# EAGLE board e1_phy (EAGLE 9.0.1)
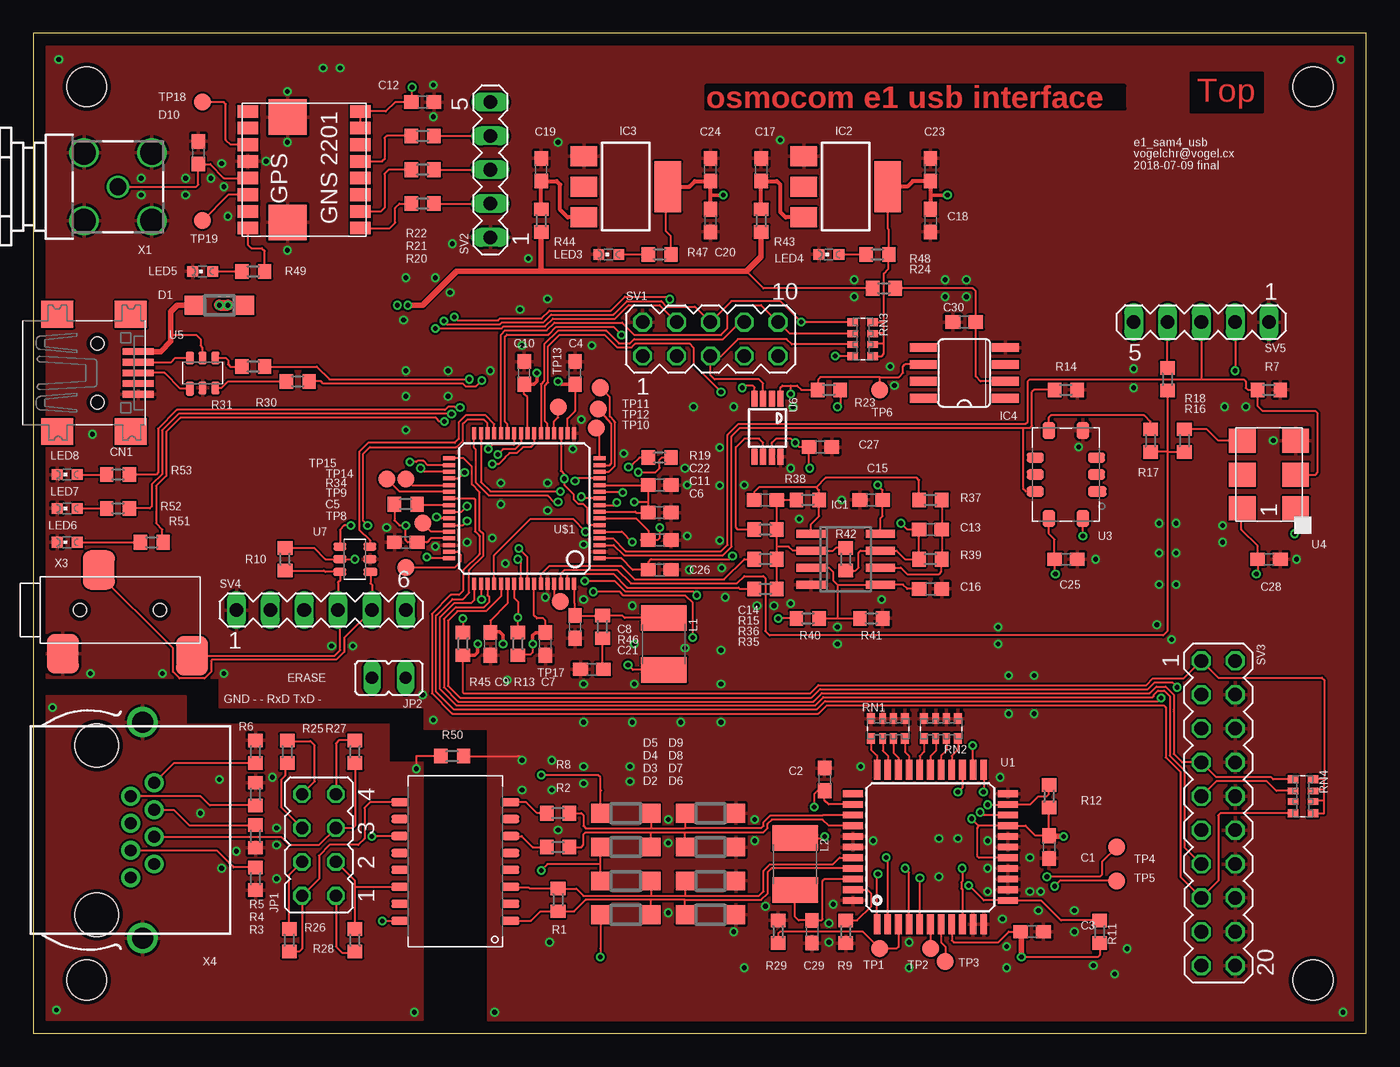
[diagram p1: board, top side]
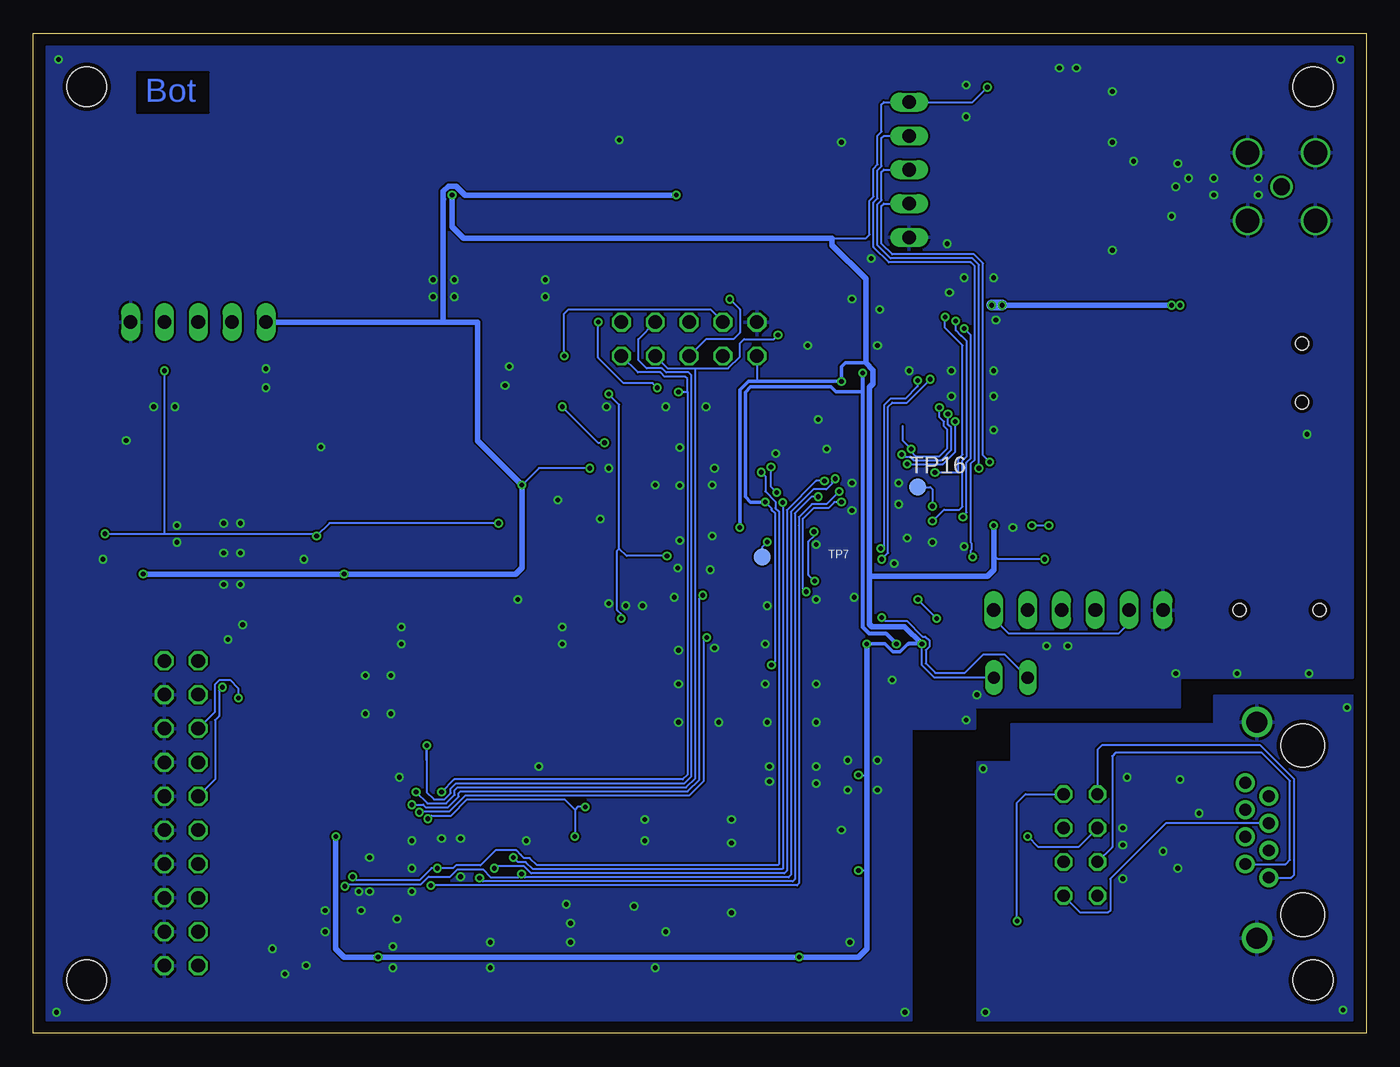
[diagram p2: board, bottom side, seen from below]

Size 100 x 75 mm. Coordinates in mm from the lower left corner, seen from the top.
Outline: 0,0 100,0 100,75 0,75 0,0
Copper layers (1*16): Top 0.035mm / dielectric 1.5mm / Bottom 0.035mm
Design rules "PCB-POOL Standard *": minimum track width 0.15mm, minimum drill 0.3mm, track to track 0.15mm, track to pad 0.15mm, pad to pad 0.15mm, via to via 0.15mm, smd to smd 0.15mm, copper to edge 0.3mm, drill to drill 0.2mm, minimum pad ring 0.2mm, minimum via ring 0.15mm, stop-mask expansion 0.075mm, vias tented up to drill 18mil, thermal gap 0.2mm
Holes 3 mm at 96,4 4,4 4,71 96,71

## Footprints (pad centres in the part's own frame; a part is rotated, then mirrored left to right if it is on the bottom)
C0603 = smd 1.1 x 1: 1 -0.85,0; 2 0.85,0
USB-MINIB = smd 0.5 x 2.308: D+ 0,4.064; D- -0.8,4.064; GND 1.6,4.064; ID 0.8,4.064; VBUS -1.6,4.064 | smd 2 x 2.4: GND1 -4.4,-2; GND2 -4.4,3.5; GND3 4.4,3.5; GND4 4.4,-2 | hole 1: -2.2,1; 2.2,1
SOD123 = smd 1.4 x 1.4: A 1.9,0; C -1.9,0
0603 = smd 1.1 x 1: 1 -0.85,0; 2 0.85,0
SO08 = smd 0.6 x 2.2: 1 -1.905,-2.6; 2 -0.635,-2.6; 3 0.635,-2.6; 4 1.905,-2.6; 5 1.905,2.6; 6 0.635,2.6; 7 -0.635,2.6; 8 -1.905,2.6
SOT223 = smd 1.5 x 2: 1 -2.3,-3.15; 2 0,-3.15; 3 2.3,-3.15 | smd 3.8 x 2: 4 0,3.15
SO08' = smd 0.66 x 2.032: 1 -1.905,-3.073; 2 -0.635,-3.073; 3 0.635,-3.073; 4 1.905,-3.073; 5 1.905,3.073; 6 0.635,3.073; 7 -0.635,3.073; 8 -1.905,3.073
JP4Q = drill 0.914 octagon: 1 -3.81,-1.27; 2 -3.81,1.27; 3 -1.27,-1.27; 4 -1.27,1.27; 5 1.27,-1.27; 6 1.27,1.27; 7 3.81,-1.27; 8 3.81,1.27
JP1 = drill 0.914 long: 1 0,-1.27; 2 0,1.27
L1812 = smd 1.9 x 3.4: 1 -1.95,0; 2 1.95,0
CHIPLED_0603 = smd 0.8 x 0.8: A 0,-0.75; C 0,0.75
R0603 = smd 1 x 1.1: 1 -0.85,0; 2 0.85,0
EXB38V = smd 0.6 x 0.8: 1 -1.275,-0.75; 4 1.275,-0.75; 5 1.275,0.75; 8 -1.275,0.75 | smd 0.5 x 0.8: 2 -0.4,-0.75; 3 0.4,-0.75; 6 0.4,0.75; 7 -0.4,0.75
MA05-2 = drill 1.016 octagon: 1 -5.08,-1.27; 2 -5.08,1.27; 3 -2.54,-1.27; 4 -2.54,1.27; 5 0,-1.27; 6 0,1.27; 7 2.54,-1.27; 8 2.54,1.27; 9 5.08,-1.27; 10 5.08,1.27
MA05-1 = drill 1.016 long: 1 -5.08,0; 2 -2.54,0; 3 0,0; 4 2.54,0; 5 5.08,0
MA10-2 = drill 1.016 octagon: 1 -11.43,-1.27; 2 -11.43,1.27; 3 -8.89,-1.27; 4 -8.89,1.27; 5 -6.35,-1.27; 6 -6.35,1.27; 7 -3.81,-1.27; 8 -3.81,1.27; 9 -1.27,-1.27; 10 -1.27,1.27; 11 1.27,-1.27; 12 1.27,1.27; 13 3.81,-1.27; 14 3.81,1.27; 15 6.35,-1.27; 16 6.35,1.27; 17 8.89,-1.27; 18 8.89,1.27; 19 11.43,-1.27; 20 11.43,1.27
MA06-1 = drill 1.016 long: 1 -6.35,0; 2 -3.81,0; 3 -1.27,0; 4 1.27,0; 5 3.81,0; 6 6.35,0
B1,27 = smd 1.27 x 1.27: TP 0,0
PULSE_BH = smd 1.27 x 0.635: 1 -4.23,4.25; 2 -4.23,2.98; 3 -4.23,1.71; 4 -4.23,0.44; 5 -4.23,-0.83; 6 -4.23,-2.1; 7 -4.23,-3.37; 8 -4.23,-4.64; 9 4.1,-4.64; 10 4.1,-3.37; 11 4.1,-2.1; 12 4.1,-0.83; 13 4.1,0.44; 14 4.1,1.71; 15 4.1,2.98; 16 4.1,4.25
TQFP44 = smd 1.5 x 0.5: 1 -5.8,4; 2 -5.8,3.2; 3 -5.8,2.4; 4 -5.8,1.6; 5 -5.8,0.8; 6 -5.8,0; 7 -5.8,-0.8; 8 -5.8,-1.6; 9 -5.8,-2.4; 10 -5.8,-3.2; 11 -5.8,-4; 23 5.8,-4; 24 5.8,-3.2; 25 5.8,-2.4; 26 5.8,-1.6; 27 5.8,-0.8; 28 5.8,0; 29 5.8,0.8; 30 5.8,1.6; 31 5.8,2.4; 32 5.8,3.2; 33 5.8,4 | smd 0.5 x 1.5: 12 -4,-5.8; 13 -3.2,-5.8; 14 -2.4,-5.8; 15 -1.6,-5.8; 16 -0.8,-5.8; 17 0,-5.8; 18 0.8,-5.8; 19 1.6,-5.8; 20 2.4,-5.8; 21 3.2,-5.8; 22 4,-5.8; 34 4,5.8; 35 3.2,5.8; 36 2.4,5.8; 37 1.6,5.8; 38 0.8,5.8; 39 0,5.8; 40 -0.8,5.8; 41 -1.6,5.8; 42 -2.4,5.8; 43 -3.2,5.8; 44 -4,5.8
GPS_GNS_2201 = smd 0.95 x 1.55: 1 -4.375,-4.225; 2 -3.125,-4.225; 3 -1.875,-4.225; 4 -0.625,-4.225; 5 0.625,-4.225; 6 1.875,-4.225; 7 3.125,-4.225; 8 4.375,-4.225; 9 4.375,4.225; 10 3.125,4.225; 11 1.875,4.225; 12 0.625,4.225; 13 -0.625,4.225; 14 -1.875,4.225; 15 -3.125,4.225; 16 -4.375,4.225 | smd 2.65 x 2.85: E1 -3.95,-1.25; E2 3.95,-1.25
VCTCXO-CONNORWINFIELD = smd 0.76 x 1.38: 1 -1.27,-2.35 | smd 0.76 x 1.28: 2 0,-2.3; 3 1.27,-2.3; 6 1.27,2.3; 7 0,2.3; 8 -1.27,2.3 | smd 1.28 x 0.94: 4 3.3,-1.27; 5 3.3,1.27; 9 -3.3,1.27; 10 -3.3,-1.27
VCXO_TAITIEN_VT_7MM_5MM = smd 1.8 x 2: 1 -2.54,-2; 2 0,-2; 3 2.54,-2; 4 2.54,2; 5 0,2; 6 -2.54,2
TSOP-6 = smd 0.6 x 1.05: 1 -0.95,-1.175 | smd 0.6 x 0.95: 2 0,-1.125; 3 0.95,-1.125; 4 0.95,1.125; 5 0,1.125; 6 -0.95,1.125
UMAX8 = smd 0.45 x 1.2: 1 -0.975,-2.175; 2 -0.325,-2.175; 3 0.325,-2.175; 4 0.975,-2.175; 5 0.975,2.175; 6 0.325,2.175; 7 -0.325,2.175; 8 -0.975,2.175
LQFP-ST-64-2 = smd 0.9 x 0.3: 1 -5.65,3.75; 2 -5.65,3.25; 3 -5.65,2.75; 4 -5.65,2.25; 5 -5.65,1.75; 6 -5.65,1.25; 7 -5.65,0.75; 8 -5.65,0.25; 9 -5.65,-0.25; 10 -5.65,-0.75; 11 -5.65,-1.25; 12 -5.65,-1.75; 13 -5.65,-2.25; 14 -5.65,-2.75; 15 -5.65,-3.25; 16 -5.65,-3.75; 33 5.65,-3.75; 34 5.65,-3.25; 35 5.65,-2.75; 36 5.65,-2.25; 37 5.65,-1.75; 38 5.65,-1.25; 39 5.65,-0.75; 40 5.65,-0.25; 41 5.65,0.25; 42 5.65,0.75; 43 5.65,1.25; 44 5.65,1.75; 45 5.65,2.25; 46 5.65,2.75; 47 5.65,3.25; 48 5.65,3.75 | smd 0.3 x 0.9: 17 -3.75,-5.65; 18 -3.25,-5.65; 19 -2.75,-5.65; 20 -2.25,-5.65; 21 -1.75,-5.65; 22 -1.25,-5.65; 23 -0.75,-5.65; 24 -0.25,-5.65; 25 0.25,-5.65; 26 0.75,-5.65; 27 1.25,-5.65; 28 1.75,-5.65; 29 2.25,-5.65; 30 2.75,-5.65; 31 3.25,-5.65; 32 3.75,-5.65; 49 3.75,5.65; 50 3.25,5.65; 51 2.75,5.65; 52 2.25,5.65; 53 1.75,5.65; 54 1.25,5.65; 55 0.75,5.65; 56 0.25,5.65; 57 -0.25,5.65; 58 -0.75,5.65; 59 -1.25,5.65; 60 -1.75,5.65; 61 -2.25,5.65; 62 -2.75,5.65; 63 -3.25,5.65; 64 -3.75,5.65
BU-SMA-G = drill 1.27: 1 0,0 | drill 1.778: 2 -2.55,2.55; 3 2.55,2.55; 4 2.55,-2.55; 5 -2.55,-2.55
JACK2.5_SJ-2523 = smd 2.4 x 2.94: 1 -4.3,-3.274; 2 5.4,-3.424; 3 -1.6,3 | hole 1: -3,0; 3,0
0446200002 = drill 0.889 pad 1.422: 1 3.556,2.54; 2 2.54,4.318; 3 1.524,2.54; 4 0.508,4.318; 5 -0.508,2.54; 6 -1.524,4.318; 7 -2.54,2.54; 8 -3.556,4.318 | drill 1.575 pad 2.286: S@1 -8.103,3.429; S@2 8.103,3.429 | hole 3.251: 6.35,0; -6.35,0

## Placement (x,y rotation side)
C1  100n  [C0603]  76.2,13.97 270 top
C2  100n  [C0603]  59.37,19.05 90 top
C3  100n  [C0603]  74.93,7.62 0 top
C4  100n  [C0603]  40.64,49.53 90 top
C5  100n  [C0603]  27.94,36.83 180 top
C6  100n  [C0603]  46.99,36.99 0 top
C7  100n  [C0603]  38.42,29.21 270 top
C8  100n  [C0603]  40.64,30.48 270 top
C9  100n  [C0603]  34.29,29.21 270 top
C10  100n  [C0603]  36.83,49.53 90 top
C11  100n  [C0603]  46.99,39.05 0 top
C12  100n  [C0603]  29.21,69.85 0 top
C13  100n  [C0603]  67.31,37.78 180 top
C14  100n  [C0603]  54.93,40.01 180 top
C15  100n  [C0603]  62.87,40.01 180 top
C16  100n  [C0603]  67.31,33.34 180 top
C17  100n  [C0603]  54.61,64.77 90 top
C18  100n  [C0603]  67.31,60.96 270 top
C19  100n  [C0603]  38.1,64.77 90 top
C20  100n  [C0603]  50.8,60.96 270 top
C21  10uF  [C0603]  41.91,27.3 180 top
C22  10uF  [C0603]  46.99,41.12 0 top
C23  10uF  [C0603]  67.31,64.77 90 top
C24  10uF  [C0603]  50.8,64.77 90 top
C25  100n  [C0603]  77.47,35.56 180 top
C26  100n  [C0603]  46.99,34.77 180 top
C27  100n  [C0603]  59.05,43.97 180 top
C28  100n  [C0603]  92.71,35.56 180 top
C29  100n  [C0603]  58.42,7.62 270 top
C30  100n  [C0603]  69.85,53.34 0 top
CN1  [USB-MINIB]  3.81,49.53 270 top
D1  MBR0520LT  [SOD123]  13.97,54.61 180 top
D2  MBR0520LT  [SOD123]  44.45,8.89 0 top
D3  MBR0520LT  [SOD123]  44.45,11.43 0 top
D4  MBR0520LT  [SOD123]  44.45,13.97 0 top
D5  MBR0520LT  [SOD123]  44.45,16.51 0 top
D6  MBR0520LT  [SOD123]  50.8,8.89 0 top
D7  MBR0520LT  [SOD123]  50.8,11.43 0 top
D8  MBR0520LT  [SOD123]  50.8,13.97 0 top
D9  MBR0520LT  [SOD123]  50.8,16.51 0 top
D10  0603ESDA-TR  [0603]  12.38,66.04 90 top
IC1  [SO08]  60.96,35.56 270 top
IC2  LD117AS33TR  [SOT223]  60.96,63.5 270 top
IC3  LD117AS33TR  [SOT223]  44.45,63.5 270 top
IC4  MAX6173AASA  [SO08']  69.85,49.53 90 top
JP1  [JP4Q]  21.43,14.13 90 top
JP2  [JP1]  26.67,26.67 90 top
L1  10uH  [L1812]  47.31,29.21 270 top
L2  10uH  [L1812]  57.15,12.7 270 top
LED3  [CHIPLED_0603]  43.18,58.42 90 top
LED4  [CHIPLED_0603]  59.69,58.42 90 top
LED5  [CHIPLED_0603]  12.7,57.15 90 top
LED6  [CHIPLED_0603]  2.54,36.83 90 top
LED7  [CHIPLED_0603]  2.54,39.37 90 top
LED8  [CHIPLED_0603]  2.54,41.91 90 top
R1  120R  [R0603]  39.37,10 90 top
R2  9R  [R0603]  39.37,13.97 180 top
R3  DNP  [R0603]  16.67,11.59 90 top
R4  DNP  [R0603]  16.67,14.76 90 top
R5  DNP  [R0603]  16.67,17.94 270 top
R6  DNP  [R0603]  16.67,21.11 270 top
R7  10k  [R0603]  92.71,48.26 180 top
R8  9R  [R0603]  39.37,16.51 180 top
R9  3k 1%  [R0603]  60.96,7.62 270 top
R10  10k  [R0603]  18.89,35.56 90 top
R11  10k  [R0603]  80.01,7.62 270 top
R12  10k  [R0603]  76.2,17.78 90 top
R13  DNP  [R0603]  36.35,29.21 90 top
R14  10k  [R0603]  77.47,48.26 0 top
R15  10k  [R0603]  54.93,37.78 0 top
R16  33R  [R0603]  86.36,44.45 90 top
R17  33R  [R0603]  83.82,44.45 90 top
R18  33R  [R0603]  85.09,49.05 90 top
R19  33R  [R0603]  46.99,43.18 0 top
R20  33R  [R0603]  29.21,62.23 180 top
R21  33R  [R0603]  29.21,64.77 180 top
R22  33R  [R0603]  29.21,67.31 180 top
R23  0R (DNP)  [R0603]  59.69,48.26 0 top
R24  BLM/0R  [R0603]  63.82,55.88 0 top
R25  DNP  [R0603]  19.05,21.11 270 top
R26  DNP  [R0603]  19.21,6.99 270 top
R27  DNP  [R0603]  24.13,21.11 90 top
R28  DNP  [R0603]  24.13,6.99 90 top
R29  10k  [R0603]  55.88,7.62 270 top
R30  33R  [R0603]  19.84,48.9 180 top
R31  33R  [R0603]  16.51,50.01 180 top
R34  DNP  [R0603]  27.94,39.69 0 top
R35  680k  [R0603]  54.93,33.34 0 top
R36  10k  [R0603]  54.93,35.56 0 top
R37  10k  [R0603]  67.31,40.01 0 top
R38  10k  [R0603]  58.1,40.01 0 top
R39  10k  [R0603]  67.31,35.56 180 top
R40  10k  [R0603]  58.1,31.11 0 top
R41  10k  [R0603]  62.87,31.11 180 top
R42  0R (DNP)  [R0603]  60.96,35.56 270 top
R43  BLM/0R  [R0603]  54.61,60.96 270 top
R44  BLM/0R  [R0603]  38.1,60.96 270 top
R45  DNP  [R0603]  32.23,29.21 90 top
R46  1R  [R0603]  42.7,30.48 90 top
R47  1k  [R0603]  46.99,58.42 0 top
R48  1k  [R0603]  63.34,58.42 0 top
R49  1k  [R0603]  16.51,57.15 0 top
R50  DNP  [R0603]  31.43,20.8 0 top
R51  1k  [R0603]  8.89,36.83 0 top
R52  1k  [R0603]  6.35,39.37 0 top
R53  1k  [R0603]  6.35,41.91 0 top
RN1  [EXB38V]  64.14,22.86 0 top
RN2  [EXB38V]  68.1,22.86 180 top
RN3  10k  [EXB38V]  62.23,52.07 270 top
RN4  10k  [EXB38V]  95.25,17.78 270 top
SV1  [MA05-2]  50.8,52.07 0 top
SV2  [MA05-1]  34.29,64.77 90 top
SV3  [MA10-2]  88.9,16.51 270 top
SV4  [MA06-1]  21.59,31.75 0 top
SV5  [MA05-1]  87.63,53.34 180 top
TP1  TPB1,27  [B1,27]  63.5,6.35 0 top
TP2  TPB1,27  [B1,27]  67.31,6.35 0 top
TP3  TPB1,27  [B1,27]  68.42,5.4 0 top
TP4  TPB1,27  [B1,27]  81.28,13.97 0 top
TP5  TPB1,27  [B1,27]  81.28,11.43 0 top
TP6  TPB1,27  [B1,27]  63.5,48.26 0 top
TP7  TPB1,27  [B1,27]  45.32,35.72 0 bottom
TP8  TPB1,27  [B1,27]  27.94,34.92 0 top
TP9  TPB1,27  [B1,27]  29.21,38.26 0 top
TP10  TPB1,27  [B1,27]  42.23,45.4 0 top
TP11  TPB1,27  [B1,27]  42.55,48.42 0 top
TP12  TPB1,27  [B1,27]  42.39,46.83 0 top
TP13  TPB1,27  [B1,27]  39.37,46.99 0 top
TP14  TPB1,27  [B1,27]  27.94,41.59 0 top
TP15  TPB1,27  [B1,27]  26.51,41.59 0 top
TP16  TPB1,27  [B1,27]  33.66,40.96 0 bottom
TP17  TPB1,27  [B1,27]  39.53,32.38 0 top
TP18  TPB1,27  [B1,27]  12.7,69.85 0 top
TP19  TPB1,27  [B1,27]  12.7,60.96 0 top
TR1  PULSE_T1094NL  [PULSE_BH]  31.59,12.7 180 top
U1  IDT82V2081  [TQFP44]  67.31,13.97 90 top
U2  GPS_GNS_2201  [GPS_GNS_2201]  20.32,64.77 270 top
U3  VCTCXO-CONNORWINFIELD  [VCTCXO-CONNORWINFIELD]  77.47,41.91 90 top
U4  VCXO_TAITIEN_VT  [VCXO_TAITIEN_VT_7MM_5MM]  92.71,41.91 90 top
U5  IP4234CZ6  [TSOP-6]  12.7,49.53 0 top
U6  [UMAX8]  55.09,45.4 180 top
U7  IP4234CZ6  [TSOP-6]  24.13,35.56 90 top
U$1  ATSAM4S_LQFP64  [LQFP-ST-64-2]  36.83,39.37 180 top
X1  BU-SMA-G  [BU-SMA-G]  6.35,63.5 180 top
X3  JACK2.5_SJ-2523  [JACK2.5_SJ-2523]  6.51,31.75 0 top
X4  0446200002  [0446200002]  4.76,15.24 270 top

## Tracks (layer width: path | path; a pad name or v marks a point on that pad's centre or on a via)
#GPS_RESET
  Top 0.152: U2.3 14.79,66.64 14.45,66.99 14.45,69.69 14.29,69.85 13.65,69.85 TP18.TP
#LIU_INT  (via drill 0.35)
  Top 0.152: v39.37,39.84 39.07,39.84 38.58,40.34 34.16,40.34 33.2,41.3 33.2,43.78 33.08,43.91 U$1.32 | U1.20 71.24,16.37 v71.03,16.58 | v49.48,29.69 49.48,32.28 48.93,32.83 44.3,32.83 44.01,33.11 v42.01,33.11
  Bottom 0.152: v39.37,39.84 39.9,39.84 40.36,39.38 41.47,39.38 42.26,38.59 42.26,33.36 v42.01,33.11 v42.01,33.12 42.07,33.18 | v71.03,16.58 70.97,16.64 68.77,16.64 67.57,17.84 50.77,17.84 49.69,18.93 49.69,29.47 v49.48,29.69
#RESET
  Top 0.152: U$1.39 33.06,40.12 33.13,40.05 33.13,37.64 33.47,37.31 33.47,35.95 32.24,34.72 32.24,33.18 31.94,32.88 31.32,32.88 29.91,31.46 29.91,25.5 31.43,23.97 58.9,23.97 59.53,24.61 84.8,24.61 84.96,24.45 84.96,20.7 86.06,19.61 86.06,11.73 SV3.15 88.9,11.43 88.9,16.35 89.05,16.5 RN4.4
#RST_LIU  (via drill 0.35)
  Top 0.152: U$1.31 33.58,41.35 34.29,40.64 v39.53,40.64 | v70.17,11.1 70.18,11.1 71.31,9.97 U1.12 75.6,9.97 77.1,8.47 R11.1
  Bottom 0.152: v39.53,40.64 40.48,39.69 41.59,39.69 42.56,38.72 42.56,38.1 42.56,11.24 42.7,11.1 v70.17,11.1
#SPI_CS0
  Top 0.152: U$1.28 35.08,52.38 35.41,52.71 38.52,52.71 39.1,53.3 44.18,53.3 45.09,52.39 51.59,52.39 52.07,52.86 52.07,53.98 52.7,54.61 54.61,54.61 SV1.10 56.75,52.47 RN3.2
#SPI_CS1  (via drill 0.35)
  Top 0.152: U$1.52 34.58,35.85 37.31,38.58 40.48,38.58 v41.43,37.62 | R12.2 76.2,17.94 76.04,17.78 75.41,17.78 74.8,17.17 U1.21 73.08,17.14 v71.6,17.14 | v49.78,32.86 49.51,33.13 44.42,33.13 43.64,33.91 v41.37,33.91
  Bottom 0.152: v71.6,17.14 70.75,17.14 70.55,16.94 68.89,16.94 68.08,17.76 68.08,18.01 67.94,18.14 50.9,18.14 50.03,19.02 50.03,32.61 v49.78,32.86 | v41.43,37.62 41.43,37.29 41.83,36.9 41.83,34.37 v41.37,33.91
#SPI_CS2  (via drill 0.35)
  Top 0.152: U$1.42 30.59,38.62 30.32,38.73 v30.25,38.73 | v30.16,52.86 35.13,52.86 35.28,53.02 38.4,53.02 38.98,53.6 43.64,53.6 44.66,54.61 46.99,54.61 SV1.4 | RN3.4 v60.17,50.8
  Bottom 0.152: v30.25,38.73 30.25,38.8 29.99,39.07 29.99,42.83 29.67,43.15 29.67,52.37 v30.16,52.86 | v60.17,50.8 60.17,53.98 59.85,54.29 49.21,54.29 SV1.4
+UB  (via drill 0.35)
  Top 0.152: R47.2 47.84,59.79 47.47,60.17 47.47,63.37 IC3.4 | IC1.8 63.56,38.64 63.72,38.79 C15.1 63.72,40.74 v63.34,41.12 | U3.9 76.2,37.47 76.62,37.05 C25.2 76.62,34.66 v76.68,34.45 | U4.6 90.65,39.31 90.65,37.78 91.86,36.57 C28.2 91.86,34.71 v91.76,34.45 | U6.7 55.41,44.3 55.72,44.61 56.83,44.61 v57.15,44.29 57.47,43.97 C27.2 58.2,42.44 v58.26,42.39 | R23.2 60.54,47.2 v60.33,46.99
  Top 0.254: 50.8,62.87 v51.75,62.87
  Top 0.305: IC3.4 49.21,63.5 49.63,63.92 C24.1 50.8,62.87 C20.1
  Bottom 0.152: v63.34,41.12 62.07,42.39 v58.26,42.39 | v60.33,46.99 57.63,44.29 v57.15,44.29
  Bottom 0.406: 69.26,62.58 69.26,63.15 68.86,63.54 68.3,63.54 67.62,62.87 v51.75,62.87 | 69.26,62.58 69.22,62.54 | v91.76,34.45 v76.68,34.45 63.82,34.45 63.34,34.92 v63.34,41.12 66.67,44.45 66.67,50.16 66.67,53.34 69.22,53.34 | SV5.5 69.22,53.34 | 69.26,62.58 69.26,53.38 69.22,53.34
AD0
  Top 0.152: U1.26 68.91,20.81 69.38,21.28 RN2.8
AD1
  Top 0.152: U1.27 68.11,20.8 68.5,21.2 RN2.7
AD2
  Top 0.152: U1.28 67.31,20.8 67.7,21.19 RN2.6
AD3
  Top 0.152: U1.29 66.51,20.79 66.83,21.11 RN2.5
AD4
  Top 0.152: U1.30 65.71,20.81 65.41,21.11 RN1.4
AD5
  Top 0.152: U1.31 64.91,20.66 64.53,21.03 RN1.3
AD6
  Top 0.152: U1.32 64.11,20.82 63.73,21.2 RN1.2
AD7
  Top 0.152: U1.33 63.31,20.83 62.86,21.28 RN1.1
CLK2048  (via drill 0.35)
  Top 0.152: v69.69,12.38 69.69,11.4 69.62,11.33 69.62,10.87 69.71,10.78 U1.9 | R19.2 47.15,43.18 46.99,43.02 46.99,42.39 46.69,42.09 v45.39,42.09 | TP4.TP 80.17,12.86 80.17,11.91 80.01,11.75 v76.04,11.75
  Bottom 0.152: v45.39,42.09 45.09,41.78 45.09,40.64 44.32,39.88 44.32,39.4 44.07,39.15 44.07,12.67 44.13,12.61 62.22,12.61 62.76,13.15 63.18,13.15 63.42,13.39 63.42,13.4 63.75,13.73 65.33,13.73 66.46,12.6 68.3,12.6 68.52,12.38 v69.69,12.38 70.13,12.38 71.02,11.5 75.79,11.5 v76.04,11.75
CLK2048_SAM4S  (via drill 0.35)
  Top 0.152: U$1.11 44.18,40.62 v44.23,40.57 | v44.65,42.48 44.7,42.48 44.85,42.63 44.93,42.63 45.48,43.18 R19.1
  Bottom 0.152: v44.23,40.57 44.65,40.99 v44.65,42.48
DAC0
  Top 0.152: U$1.59 38.08,34.43 38.72,35.07 44.09,35.07 45.12,34.04 51.82,34.04 53.34,35.56 R36.1
DAC1
  Top 0.152: U$1.63 40.08,34.38 40.16,34.46 43.52,34.46 44.55,33.44 52.92,33.44 53.02,33.34 R35.1
DAC_I2C
  Top 0.152: R15.1 52.86,37.78 52.7,37.94 52.7,43.97 53.34,44.61 54.45,44.61 54.76,44.3 U6.6
E1_LINE_RX_A  (via drill 0.35)
  Top 0.152: R27.2 22.92,21.96 22.7,21.75 JP1.7 | TR1.16 27.45,8.41 v26.19,8.41
  Bottom 0.152: v26.19,8.41 26.19,17.3 25.56,17.94 JP1.7
E1_LINE_RX_B
  Top 0.152: R28.2 24.13,10.95 | 24.13,10.95 24.13,11.43 JP1.3 | TR1.14 27.45,10.95 24.13,10.95
E1_LINE_TX_A  (via drill 0.35)
  Top 0.152: R25.2 18.89,20.11 18.89,19.32 18.59,19.02 18.59,16.97 JP1.6 | TR1.11 27.45,14.76 v25.4,14.76
  Bottom 0.152: JP1.6 21.59,13.97 24.61,13.97 v25.4,14.76
E1_LINE_TX_B
  Top 0.152: R26.2 19.95,6.13 20.16,6.35 JP1.2 21.43,11.59 21.43,13.34 22.23,14.13 24.37,14.13 24.85,14.61 24.85,16.91 25.28,17.34 TR1.9
GND  (via drill 0.35)
  Top 0.152: R50.2 36.35,20.8 arc-90 v36.67,20.48
  other vias: 32.54,36.83 34.45,37.15 30.16,36.51 26.51,37.94 41.27,36.67 38.42,32.7 41.27,32.54 49.21,34.77 41.12,46.04 38.58,41.27 35.08,41.27 35.08,39.69 41.91,51.59 36.67,51.59 36.51,54.29 38.58,55.09 60.64,40.01 56.83,32.23 63.66,32.54 57.47,38.58 79.69,35.56 78.42,43.97 93.03,44.45 94.77,35.56 21.75,72.39 23.02,72.39 31.27,55.56 4.45,44.93 49.05,37.31 49.05,41.12 40.48,43.81 34.29,49.69 31.11,49.69 27.94,49.69 27.94,47.78 31.11,47.78 27.94,45.24 53.34,41.12 52.55,46.99 56.99,46.99 30.16,56.67 39.37,66.83 56.04,66.99 22.38,29.05 4.29,26.99 98.27,1.59 98.11,73.03 1.91,73.03 38.58,39.21 35.4,35.24 41.27,18.73 41.27,20 44.77,20 44.77,18.89 38.89,18.26 36.67,18.26 38.89,20.48 39.37,15.24 47.62,16.03 47.62,14.29 54.13,16.03 54.13,14.45 47.62,9.05 52.55,7.62 63.02,14.45 67.94,11.75 65.72,6.83 72.71,8.57 65.72,4.92 54.93,9.53 53.34,4.92 78.11,9.21 74.77,10.64 34.61,1.59 38.73,6.83 51.49,41.09 51.49,43.95 51.49,36.96 51.65,34.9 62.07,20 72.55,19.21 74.77,13.18 71.6,14.45 69.37,14.61 67.94,14.61 23.97,29.05 14.29,26.99 9.68,26.99 35.56,26.51 30,23.5 41.27,23.34 41.27,26.19 44.93,32.07 44.93,23.34 48.58,23.34 51.59,23.34 51.59,26.19 73.18,23.97 75.09,23.97 75.09,26.83 73.18,26.83 45.09,26.19 48.9,28.89 45.09,29.21 51.91,32.7 29.21,25.4 49.53,46.99 75.56,10.64 75.41,9.21 78.11,7.62 71.6,12.38 59.69,8.26 60.01,9.68 73.03,6.51 81.12,4.45 79.53,5.08 82.07,6.35 82.55,48.42 82.55,49.85 89.38,46.99 90.96,46.99 89.22,38.1 89.22,36.83 48.9,42.39 44.29,43.5 31.43,59.21 27.94,56.67 27.78,53.5 37.15,58.1 30,68.74 14.29,63.5 14.13,65.25 13.34,64.14 14.61,61.28 11.43,62.87 11.43,64.14 8.1,64.14 8.1,62.87 19.05,58.74 30,71.12 19.05,70.64 19.05,66.83 17.46,65.41 64.29,50.01 64.61,48.58 70.01,55.24 70.01,56.52 68.42,56.52 68.42,55.24 61.59,56.52 61.59,55.24 59.69,6.83 73.03,4.92 51.59,28.73 71.6,10.64 56.83,42.39 60.33,30.48 60.33,29.21 54.29,32.07 55.56,32.07 72.39,30.48 72.39,29.21 84.3,30.64 85.41,29.53 85.72,33.66 85.72,36.04 85.72,38.26 84.45,38.26 84.45,36.04 84.45,33.66
  pour Bottom (rank 2): 99,74 1,74 1,26.65 13.97,26.65 13.97,24.45 29.37,24.45 29.37,22.86 34.13,22.86 34.13,1 99,1
  pour Top (rank 2): 99,74 1,74 1,26.65 13.97,26.65 13.97,24.45 29.37,24.45 29.37,22.86 34.13,22.86 34.13,1 99,1
GNDIO  (via drill 0.35)
  Top 0.152: R50.1 28.73,20.8 v28.73,19.84
  other vias: 28.57,1.59 1.75,1.75 1.43,24.45 17.94,19.21 18.26,11.59 18.26,14.13 18.26,15.4 15.24,13.65 14.13,12.38 12.54,16.51 13.97,19.05
  pour Top: 1,25.33 11.43,25.33 11.43,23.16 26.67,23.16 26.67,20.32 29.21,20.32 29.21,1 1,1
  pour Bottom: 1,25.33 11.43,25.33 11.43,23.16 26.67,23.18 26.67,20.32 29.21,20.32 29.21,1 1,1
GPS_3DFIX
  Top 0.152: R49.2 17.36,58.68 17.14,58.9 16.35,58.9 16.09,59.15 U2.8
GPS_PPS  (via drill 0.35)
  Top 0.152: U$1.48 29.63,35.62 v29.53,35.72 | R22.1 SV2.4
  Bottom 0.152: v29.53,35.72 29.69,35.88 29.69,36.21 29.61,36.28 29.61,36.74 29.69,36.82 29.69,42.7 29.37,43.02 29.37,57.52 29.67,57.81 35.81,57.81 36.96,58.96 36.96,62.32 36.66,62.62 36.66,64.74 36.35,65.04 36.35,67.15 36.2,67.31 SV2.4
GPS_RF
  Top 0.152: U2.5 14.29,64.14 13.28,65.19 D10.1 12.38,63.66 12.22,63.5 X1.1
GPS_RX_A
  Top 0.152: U2.9 26.74,60.4 27.15,60.8 27.15,61.91 27.46,62.23 R20.2
GPS_SAM4_RX  (via drill 0.35)
  Top 0.152: U$1.35 29.32,42.12 v29.05,42.39 | R21.1 SV2.3
  Bottom 0.152: v29.05,42.39 29.05,57.63 29.54,58.12 35.69,58.12 36.66,59.09 36.66,62.2 36.35,62.5 36.35,64.61 36.2,64.77 SV2.3
GPS_SAM4_TX  (via drill 0.35)
  Top 0.152: v28.26,42.86 28.75,42.86 28.82,42.94 29.28,42.94 29.6,42.62 U$1.34 | R20.1 SV2.2
  Bottom 0.152: v28.26,42.86 28.75,43.35 28.75,57.75 29.42,58.42 35.56,58.42 36.35,59.21 36.35,62.07 36.2,62.23 SV2.2
GPS_WAKEUP
  Top 0.152: U2.6 14.63,62.9 TP19.TP
I2C_SCL  (via drill 0.35)
  Top 0.152: U$1.36 31.9,41.62 v32.35,42.07 | v31.6,53.72 31.85,53.47 34.88,53.47 35.03,53.62 38.15,53.62 38.73,54.2 43.34,54.2 44.38,55.24 47.56,55.24 v47.75,55.06 | RN3.3 56.91,51.67 56.52,52.07 52.86,52.07 51.59,50.8 SV1.5 50.8,49.37 51.12,49.05 54.45,49.05 54.76,48.74 U6.3
  Bottom 0.152: v32.35,42.07 30.59,42.07 30.59,43.08 30.28,43.4 30.28,51.59 31.6,52.91 v31.6,53.72 | v47.75,55.06 46.99,54.3 46.99,52.55 47.47,52.07 49.53,52.07 SV1.5
I2C_SDA  (via drill 0.35)
  Top 0.152: U$1.43 32.25,38.12 v32.54,38.42 | v30.8,53.41 31.05,53.17 35.01,53.17 35.16,53.32 38.27,53.32 38.85,53.9 43.52,53.9 44.53,54.91 47.12,54.91 47.52,54.51 49.63,54.51 SV1.6 52.37,54.91 56.05,54.91 v57.62,53.34 RN3.1 | U6.4 54.11,48.44 53.98,48.58 53.34,48.58 v53.18,48.42
  Bottom 0.152: v32.54,38.42 31.68,39.29 30.52,39.29 30.29,39.51 30.29,42.95 29.97,43.27 29.97,51.91 30.38,52.31 30.39,52.31 30.8,52.72 v30.8,53.41 | v53.18,48.42 53.53,48.77 55.7,48.77 57.62,50.69 v57.62,53.34
JTAGSEL  (via drill 0.35)
  Top 0.152: v32.23,31.11 R45.2 | U$1.50 33.58,32.59 arc90 v33.63,32.54
  Bottom 0.152: v32.23,31.11 33.63,32.52 v33.63,32.54
LED1  (via drill 0.35)
  Top 0.152: U$1.23 37.58,44.25 37.31,43.97 36.73,43.97 36.27,43.51 35.72,43.51 35.41,43.2 35.41,43.18 34.92,42.69 v34.44,42.69 | v30.83,45.88 30.48,45.88 30.2,46.16 11.03,46.16 9.97,45.1 9.97,41.82 9.21,41.05 9.21,38.26 9.68,37.78 9.68,36.89 R51.2
  Bottom 0.152: v34.44,42.69 31.76,42.69 30.83,43.63 v30.83,45.88
LED2  (via drill 0.35)
  Top 0.152: v34.86,43.41 34.86,43.43 35.24,43.81 36.15,43.81 36.58,44.25 U$1.25 | v31.38,46.46 10.9,46.46 9.67,45.23 9.67,41.94 8.89,41.16 8.89,39.53 8.73,39.37 R52.2
  Bottom 0.152: v34.86,43.41 34.69,43.24 34.21,43.24 33.96,43 31.89,43 31.13,43.75 31.13,45.4 31.38,45.65 31.38,46.11 | 31.38,46.11 | 31.38,46.11 v31.38,46.46
LED3  (via drill 0.35)
  Top 0.152: U$1.26 36.08,44.18 36.04,44.13 34.45,44.13 v34.13,43.81 | v32.02,46.95 31.67,46.95 31.61,47.01 31.14,47.01 30.89,46.76 10.77,46.76 9.37,45.35 9.37,42.07 9.21,41.91 R53.2
  Bottom 0.152: 34.77,45.56 34.77,44.45 v34.13,43.81 34.13,43.62 33.81,43.3 32.01,43.3 31.43,43.88 31.43,45.28 31.68,45.52 31.68,45.88 32.02,46.22 v32.02,46.95
LINE_PIN1
  Top 0.152: JP1.8 21.11,18.89 21.11,21.59 20.8,21.91 19.11,21.91 R25.1
  Bottom 0.152: X4.1 5.62,11.68 5.4,11.91 5.4,19.05 7.94,21.59 19.84,21.59 20.16,21.27 JP1.8
LINE_PIN2
  Top 0.152: R26.1 19.21,11.91 JP1.4
  Bottom 0.152: X4.2 6.03,12.7 5.71,13.02 5.71,18.94 7.81,21.04 18.81,21.04 19.05,20.8 19.05,13.97 JP1.4
LINE_PIN3
  Top 0.152: X4.3 13.75,13.72 14.68,12.78 14.76,12.7 15.03,12.44 R3.2
LINE_PIN4
  Top 0.152: R27.1 24.13,15.56 23.97,15.4 JP1.5 21.43,14.13 19.21,14.13 18.61,14.73 X4.4
LINE_PIN5
  Top 0.152: R28.1 24.13,6.03 23.18,6.03 22.7,6.51 JP1.1
  Bottom 0.152: X4.5 15.05,15.75 19.21,11.59 19.21,9.21 19.37,9.05 21.43,9.05 JP1.1
LINE_PIN6
  Top 0.152: R4.2 11.69,15.61 10.54,16.76 X4.6
LINE_PIN7
  Top 0.152: R5.2 13.23,17.09 12.54,17.78 X4.7
LINE_PIN8
  Top 0.152: R6.2 10.55,20.26 X4.8
LIU_VDDA
  Top 0.152: L2.2 57.15,8.73 57.41,8.47 C29.1 59.11,8.47 59.21,8.57 59.21,11.43 59.35,11.57 U1.42
N$1
  Top 0.152: CN1.D+ 9.84,49.53 11.02,48.35 U5.1
N$2
  Top 0.152: CN1.D- 10.32,50.33 10.65,50.66 U5.6
N$3
  cutout Top: 86.84,72.07 92.23,72.07 92.23,69.06 86.84,69.06
  cutout Bottom: 86.84,72.07 92.23,72.07 92.23,69.06 86.84,69.06
N$4
  Top 0.152: U1.6 TP2.TP
N$5
  Top 0.152: TR1.6 36.63,14.8 37.47,13.97 R2.2
N$6
  Top 0.152: U1.3 64.91,6.49 64.77,6.35 TP1.TP 62.23,7.62 56.04,7.62 55.88,7.46 R29.2
N$8
  Top 0.152: U1.7 68.11,6.82 68.42,6.51 TP3.TP
N$9
  Top 0.152: R24.2 70.48,55.88 70.7,55.66 C30.2 70.7,49.27 71.07,48.9 IC4.2
N$11
  Top 0.152: LED5.A R49.1
N$13
  Top 0.305: IC3.3 40.08,61.2 39.53,61.75 39.53,63.66 39.27,63.92 C19.1 R44.1
N$14
  Top 0.305: R43.1 C17.1 55.78,63.92 56.04,63.66 56.04,61.59 56.43,61.2 IC2.3
N$15
  Top 0.152: R46.1 42.7,27.46 42.44,27.2 C21.1
N$16
  Top 0.152: LED3.A R47.1
N$17  (via drill 0.35)
  Top 0.152: U$1.41 32.13,39.12 v32.54,39.53
  Bottom 0.152: TP16.TP 32.7,40.96 32.54,40.8 v32.54,39.53
N$18
  Top 0.152: LED4.A R48.1
N$25
  Top 0.152: R8.2 37.78,16.51 36.95,17.34 TR1.8
N$26
  Top 0.152: LED6.A R51.1
N$27
  Top 0.152: LED7.A R52.1
N$28
  Top 0.152: LED8.A R53.1
N$30
  Top 0.152: U2.13 26.18,65.39 26.35,65.56 26.35,67.15 26.51,67.31 R22.2
N$31
  Top 0.152: U1.43 62.57,10.77 62.87,10.48 62.87,9.53 61.81,8.47 R9.1
N$32
  Bottom 0.152: SV4.2 17.78,30.8 18.57,30 26.83,30 27.94,31.11 SV4.6
OPAMP1_IN_NEG
  Top 0.152: R35.2 R36.2 55.78,36.51 | 55.78,36.51 R15.2 C14.1 R38.1 | 55.78,36.51 56.67,36.51 56.99,36.2 IC1.2 60.01,36.2 60.22,36.41 R42.1
OPAMP1_OUT
  Top 0.152: C14.2 54.08,40.58 54.45,40.96 58.74,40.96 | 58.74,40.96 58.95,40.74 R38.2 58.95,38.79 58.36,38.2 IC1.1 | R37.1 66.46,41.49 66.28,41.67 59.45,41.67 58.74,40.96
OPAMP2_IN_NEG
  Top 0.152: R37.2 C13.1 R39.1 68.1,35.5 68.1,34.61 67.94,34.45 65.56,34.45 65.09,34.92 IC1.6
PB12_ERASE  (via drill 0.35)
  Top 0.152: U$1.55 36.08,32.66 36.35,32.38 v36.35,31.19 R13.2
  Bottom 0.152: v36.35,31.19 36.1,30.94 34.46,30.94 33.28,29.76 33.07,29.76 32.79,29.48 32.79,28.98 33.03,28.73 33.03,27.75 32.33,27.04 30.11,27.04 28.73,28.42 27.15,28.42 JP2.2
RRING
  Top 0.152: 46.35,10.32 41.27,10.32 40.74,10.85 R1.2 37.25,10.85 37.15,10.95 35.86,10.95 TR1.3 | 46.35,10.32 48.9,10.32 | D3.A 46.35,10.32 | D7.C 48.9,10.32 | U1.40 60.48,13.18 59.98,12.67 55.27,12.67 54.78,12.19 54.78,10.65 54.46,10.32 48.9,10.32
RTIP
  Top 0.152: 48.9,10 46.35,10 | 46.35,10 41.43,10 40.58,9.15 R1.1 38.04,9.15 37.34,8.45 TR1.1 | D2.A 46.35,10 | D6.C 48.9,10 | 61.5,12.38 U1.41 55.39,12.37 55.09,12.06 55.09,10.48 54.61,10 48.9,10
RX_CLK  (via drill 0.35)
  Top 0.152: U$1.13 40.83,41.62 v40.64,41.43 | U1.4 65.71,12.08 v65.41,12.38
  Bottom 0.152: v40.64,41.43 41.27,41.43 43.47,39.24 43.47,12.19 43.66,12.01 62.65,12.01 63.18,12.54 65.25,12.54 v65.41,12.38
RX_DATA  (via drill 0.35)
  Top 0.152: U$1.10 41.24,40.12 v41.12,40.25 | U1.5 66.51,11.9 66.52,11.91 v66.52,11.65
  Bottom 0.152: v41.12,40.25 41.61,40.25 42.86,38.99 42.86,11.56 43.02,11.4 66.27,11.4 v66.52,11.65
SAM4S_CLK
  Top 0.152: U$1.62 39.58,34.5 39.85,34.77 43.8,34.77 44.83,33.74 52.79,33.74 53.34,34.29 54.77,34.29 54.93,34.13 54.93,30.16 55.24,29.84 84.77,29.84 85.09,30.16 85.09,43.66 | R18.1 85.09,43.66 | R17.1 83.88,43.66 85.09,43.66 | R16.1 85.15,43.6 85.09,43.66
SAM4S_CLK_EXT
  Top 0.152: R18.2 SV5.4
SAM4S_CLK_VCTXO
  Top 0.152: U3.5 76.2,46.2 76.36,46.35 83.34,46.35 83.82,45.88 R17.2
SAM4S_CLK_VCXO
  Top 0.152: R16.2 88.05,45.3 88.9,44.45 U4.4
SPI_MISO  (via drill 0.35)
  Top 0.152: U$1.27 35.58,45.68 35.38,45.88 35.38,52.26 35.54,52.41 38.65,52.41 39.23,52.99 43.53,52.99 v44.13,52.39 | U1.23 71.31,18.13 v71.28,18.1
  Bottom 0.152: v71.28,18.1 70.42,17.24 69.02,17.24 68.38,17.88 68.38,18.23 68.17,18.45 59.37,18.45 51.03,18.45 50.33,19.14 50.33,49.86 50.32,49.87 | v44.13,52.39 44.45,52.07 46.67,52.07 46.99,51.75 46.99,50.75 47.87,49.87 50.32,49.87 | SV1.7 52.41,49.87 50.32,49.87
SPI_MOSI  (via drill 0.35)
  Top 0.152: U$1.22 38.08,48.69 38.33,48.95 38.33,51.67 39.35,52.69 42.99,52.69 43.92,51.75 44.77,51.75 45.09,52.07 51.75,52.07 53.02,53.34 SV1.8 | U1.24 70.48,19.8 v70.48,21.59
  Bottom 0.152: 70.48,20.48 v70.48,21.59 70.48,18.1 69.93,17.55 69.14,17.55 68.68,18.01 68.68,18.36 68.3,18.75 51.15,18.75 50.63,19.27 50.63,49.36 50.83,49.56 52.53,49.56 52.83,49.87 53.99,49.87 54.61,50.48 54.61,52.07 SV1.8
SPI_SCK  (via drill 0.35)
  Top 0.152: U$1.21 38.58,45.72 38.38,45.91 38.38,48.57 38.64,48.82 38.64,51.54 39.48,52.39 42.86,52.39 43.8,51.45 44.89,51.45 45.2,51.75 49.21,51.75 49.53,51.44 49.53,50.16 v51.59,48.1 | U1.25 69.71,18.43 v69.37,18.1
  Bottom 0.152: 50.93,48.1 50.93,19.39 51.28,19.05 68.42,19.05 v69.37,18.1 | v51.59,48.1 50.93,48.1 | SV1.9 54.64,49.56 52.96,49.56 52.66,49.26 51.12,49.26 50.93,49.08 50.93,48.1
TCK_SWDCLK  (via drill 0.35)
  Top 0.152: SV3.9 88.76,18.91 92.54,18.91 93.26,18.18 RN4.2 | U$1.53 35.08,32.78 33.96,31.67 31.82,31.67 31.11,30.96 31.11,26.07 32,25.18 58.4,25.18 59.03,25.82 83.64,25.82 84.14,26.31 85.44,26.31 v85.8,25.95
  Bottom 0.152: SV3.9 86.36,19.05 86.36,23.5 86.06,23.8 86.06,25.7 v85.8,25.95
TDI  (via drill 0.35)
  Top 0.152: U$1.33 32.29,43.12 32.9,42.51 32.9,41.17 33.5,40.58 33.5,37.71 33.77,37.43 33.77,35.82 32.7,34.75 32.7,33.05 32.23,32.57 31.45,32.57 30.21,31.33 30.21,25.62 31.56,24.27 58.77,24.27 59.41,24.91 84.36,24.91 v84.61,25.16
  Bottom 0.152: SV3.5 86.36,24.13 86.36,26.18 86.03,26.51 85.24,26.51 84.61,25.88 v84.61,25.16
TDO
  Top 0.152: U$1.49 33.08,32.49 32.86,32.27 31.57,32.27 30.51,31.21 30.51,25.82 31.75,24.58 58.65,24.58 59.28,25.21 83.98,25.21 84.06,25.3 84.06,25.39 84.39,25.71 84.84,25.71 85.26,25.29 85.26,20.83 86.36,19.73 86.36,13.97 SV3.13
TMS_SWDIO
  Top 0.152: U$1.51 34.08,32.87 34.18,32.77 34.18,32.31 33.84,31.97 31.7,31.97 30.81,31.08 30.81,25.94 31.88,24.88 58.52,24.88 59.16,25.51 83.76,25.51 84.26,26.01 84.97,26.01 85.57,25.41 85.57,24.29 85.57,24.13 85.57,20.95 86.2,20.32 SV3.7 88.74,19.21 92.87,19.21 93.02,19.05 RN4.1
TP7  (via drill 0.35)
  Top 0.152: U$1.5 44.15,37.62 v44.92,36.84
  Bottom 0.152: v44.92,36.84 45.32,36.45 TP7.TP
TP8
  Top 0.152: U$1.47 31.82,36.12 32.07,35.88 32.07,35.4 31.59,34.92 TP8.TP
TP9
  Top 0.152: U$1.44 29.85,37.62 TP9.TP
TP10
  Top 0.152: U$1.16 42.48,44.83 arc90 TP10.TP
TP11
  Top 0.152: 42.53,42.07 U$1.14 43.18,42.12 43.64,42.58 43.64,45.71 43.65,45.82 43.64,45.83 43.64,45.84 43.56,45.93 43.27,46.27 43.27,47.7 TP11.TP
TP12
  Top 0.152: U$1.15 43.26,42.62 43.34,42.7 43.34,45.72 TP12.TP
TP13
  Top 0.152: U$1.20 39.08,45.91 39.37,46.2 TP13.TP
TP14
  Top 0.152: TP14.TP 28.41,41.12 U$1.37
TP15
  Top 0.152: U$1.38 27.48,40.62 TP15.TP
TP17
  Top 0.152: U$1.61 39.08,32.83 TP17.TP
TPS_TX_A
  Top 0.152: U2.10 26.09,61.65 26.35,61.91 26.35,64.45 26.67,64.77 R21.2
TRING
  Top 0.152: R8.1 41.12,16.51 41.27,16.35 41.27,15.56 41.43,15.4 46.35,15.4 | 46.35,15.4 48.9,15.4 | D5.A 46.35,15.4 | D9.C 48.9,15.4 | 48.9,15.4 54.63,15.4 54.78,15.56 54.78,15.84 55.27,16.33 55.28,16.34 59.2,16.34 59.23,16.37 U1.36
TST
  Top 0.152: U$1.40 28.86,39.62 R34.2
TTIP
  Top 0.152: R2.1 41.12,13.97 41.27,14.13 41.27,14.92 41.43,15.08 46.35,15.08 | 46.35,15.08 48.9,15.08 | D4.A 46.35,15.08 | D8.C 48.9,15.08 | U1.37 59.68,15.57 59.21,16.03 55.4,16.03 55.09,15.72 55.09,15.4 54.77,15.08 48.9,15.08
TX_CLK  (via drill 0.35)
  Top 0.152: U$1.19 39.58,42.18 39.85,41.91 v39.85,41.6 | v39.85,41.6 v39.84,41.59 | v39.85,41.6 39.85,41.12 40.56,40.4 40.56,40.02 40.89,39.7 41.27,39.7 41.59,39.37 41.59,38.26 41.73,38.12 U$1.6 | U1.1 63.31,11.89 v63.37,11.95 | TP5.TP 77.01,11.43 v76.62,11.03
  Bottom 0.152: v39.84,41.59 40.09,41.34 40.09,41.2 40.49,40.8 41.48,40.8 43.16,39.12 43.16,11.88 43.34,11.7 63.12,11.7 v63.37,11.95 63.62,11.7 65.68,11.7 66.27,12.3 68.17,12.3 68.72,11.75 70.34,11.75 70.89,11.2 76.45,11.2 v76.62,11.03
TX_DATA  (via drill 0.35)
  Top 0.152: U$1.9 43.59,39.62 v43.77,39.8 43.81,39.85 | U1.2 64.11,13.04 v63.98,13.18
  Bottom 0.152: v63.98,13.18 63.64,12.84 63.06,12.84 62.52,12.31 43.81,12.31 43.77,12.35 v43.77,39.8
URXD0_SAMBA_RX  (via drill 0.35)
  Top 0.152: v23.81,38.1 23.34,38.1 23,37.77 U7.4 | v25.08,38.1 24.75,38.43 24.75,43.48 25.24,43.97 31.75,43.97 32.23,44.45 32.23,45.72 32.54,46.04 33.81,46.04 34.08,45.77 U$1.30
  Bottom 0.152: v25.08,38.1 v23.81,38.1
URXD0_SAMBA_RX_CON
  Top 0.152: X3.2 22.61,28.33 23.02,28.73 23.02,31.59 SV4.4 22.86,33.81 23,33.96 U7.6 21.91,34.61 21.8,34.71 R10.1
USB_DDM  (via drill 0.35)
  Top 0.152: U$1.56 36.58,35.33 v36.35,35.56 | R31.1 21.27,50.01 22.23,49.05 v32.7,49.05
  Bottom 0.152: v36.35,35.56 35.88,36.04 35.88,46.99 35.56,47.31 34.45,47.31 v32.7,49.05
USB_DDM_CON
  Top 0.152: U5.4 14.43,50.66 14.61,50.48 14.61,50.16 14.76,50.01 R31.2
USB_DDP  (via drill 0.35)
  Top 0.152: U$1.57 37.08,35.71 v36.43,36.36 | v33.66,48.97 33.19,48.5 32.47,48.5 32.24,48.74 21.75,48.74 21.59,48.9 R30.1
  Bottom 0.152: v33.66,48.97 33.66,48.53 34.57,47.61 35.69,47.61 36.18,47.12 36.18,43.81 36.18,36.53 36.35,36.36 v36.43,36.36
USB_DDP_CON
  Top 0.152: U5.3 14.12,48.41 14.61,48.9 R30.2
USB_VBUS  (via drill 0.35)
  Top 0.152: R24.1 54.77,55.88 53.5,57.15
  Top 0.406: R43.2 54.61,58.26 53.5,57.15 38.1,57.15 | R44.2 38.1,57.15 | 38.1,57.15 31.75,57.15 29.21,54.61 v28.1,54.61 | D1.C v14.61,54.61
  Top 0.813: v13.97,54.61 v14.61,54.61
  Bottom 0.406: v27.3,54.61 v14.61,54.61
  Bottom 0.813: v27.3,54.61 v28.1,54.61
UTXD0_SAMBA_TX
  Top 0.152: U7.3 25.25,36.98 24.45,37.78 24.45,43.61 25.12,44.28 31.62,44.28 31.92,44.58 31.92,45.84 32.42,46.34 33.94,46.34 34.58,45.7 U$1.29
UTXD0_SAMBA_TX_CON
  Top 0.152: U7.1 25.3,33.75 25.4,33.66 SV4.5 23.32,29.67 23.32,28.61 22.74,28.02 13.42,28.02 13.34,27.94 13.34,27.11 12.85,26.63 10.97,26.63 10.48,27.11 10.48,28.89 4.62,34.75 | 4.45,34.92 4.62,34.75 | 4.62,34.75 X3.3
VBUS_CONN
  Top 0.152: U5.5 12.7,51.44 12.54,51.59 12.54,52.07 12.22,52.39 10.32,52.39
  Top 0.406: CN1.VBUS 9.54,51.13 10.32,51.91 10.32,52.39 10.32,54.13 10.79,54.61 D1.A
VCC  (via drill 0.35)
  Top 0.152: U$1.45 29.82,37.12 29.53,36.83 C5.1 28.1,36.83 27.94,36.99 v27.94,38.1 27.46,38.1 27.09,38.47 R34.1 | U$1.18 40.08,46.11 40.64,46.67 C4.1 | U$1.58 37.58,31.32 37.78,31.11 38.26,31.11 38.42,30.96 C7.1 | U$1.7 45.2,38.62 46.14,37.68 C6.1 | C6.1 45.56,36.99 | U2.15 U2.16 26.44,69.14 27.15,69.85 C12.1 28.42,69.91 v28.42,70.96 | IC2.4 64.14,63.48 64.14,60.33 64.19,60.27 R48.2 64.14,58.36 64.14,57.31 63.81,56.99 63.81,53.34 | U1.8 68.91,6.97 69.06,6.83 72.39,6.83 73.18,7.62 C3.1 | U1.16 70.97,13.17 70.8,13.34 70.8,15.4 70.88,15.48 | 70.88,15.48 70.97,15.57 U1.19 74.44,15.57 75.19,14.82 C1.1 R12.1 | U1.35 59.66,17.17 59.37,17.46 C2.1 58.84,18.2 58.58,17.94 v58.58,16.99 | D3.C 42.55,12.7 | 42.55,12.7 D4.C | 42.55,12.7 38.58,12.7 v38.1,12.22 | D2.C 42.55,6.36 v42.55,5.71 | D5.C 42.55,18.26 | 42.55,18.26 42.55,19.2 42.39,19.37 v38.1,19.37 | 42.61,18.2 42.55,18.26 | v37.47,29.21 37.47,28.57 37.31,28.42 36.41,28.42 R13.1 | SV3.1 87.58,27.89 | v24.13,35.56 U7.5 21.91,35.56 21.06,36.41 R10.2 | RN3.5 63.65,50.8 63.82,50.96 63.82,51.75 | 63.82,51.75 63.82,52.55 | 63.82,52.55 63.82,53.34 63.81,53.34 | RN3.8 63.81,53.34 | RN3.7 63.06,52.55 63.82,52.55 | RN3.6 63.06,51.75 63.82,51.75 | RN4.8 96.84,19.05 | RN4.7 96.08,18.26 96.84,18.26 | RN4.6 96.08,17.46 96.84,17.46 | RN4.5 96.83,16.5 96.84,16.51 96.84,17.46 | 96.84,17.46 96.84,18.26 | 96.84,18.26 96.84,19.05 | SV3.1 88.9,26.67 96.68,26.67 96.84,26.51 96.84,19.05 | R11.2 80.01,5.87 79.85,5.71 v74.14,5.71 | 77.42,14.65 v77.31,14.76 | L2.1 59.26,14.65 v59.37,14.76 | v46.99,37.94 46.99,37.15 46.83,36.99 C6.1 | R45.1 32.23,25.56 32.3,25.48 58.27,25.48 58.91,26.12 83.51,26.12 84.01,26.62 86.31,26.62 SV3.1
  Top 0.152: v70.39,16.09 70.88,15.6 70.88,15.48
  Top 0.254: C4.1 39.59,48.68 v39.37,48.9 | C7.1 37.68,30.06 37.47,29.84 v37.47,29.21 | v33.34,29.21 33.34,28.57 33.12,28.36 R45.1 | v68.58,62.87 67.31,62.87
  Top 0.305: C18.1 67.31,62.87 C23.1 65.98,63.92 65.56,63.5 IC2.4
  Top 0.406: C3.1 74.14,7.56 v74.14,5.71 | C1.1 76.26,14.76 v77.31,14.76
  Bottom 0.152: v38.1,19.37 37.47,19.37 | v38.1,12.22 37.47,12.22 | JP2.1 32.38,26.67 33.34,27.62 v33.34,29.21 | v24.13,35.56 27.62,35.56 27.94,35.88 v27.94,38.1 | SV1.1 45.72,48.9 | 59.37,16.78 v59.37,14.76 | v28.42,70.96 29.53,69.85 SV2.5 36.2,69.85 36.35,69.69 36.35,67.63 36.66,67.33 36.66,65.16 36.96,64.86 36.96,62.75 37.26,62.45 37.26,59.89 37.53,59.62 40.07,59.62 | v70.39,16.09 70.14,16.34 68.64,16.34 67.44,17.54 60.13,17.54 59.37,16.78 | v58.58,16.99 59.17,16.99 59.37,16.78
  Bottom 0.254: v39.37,48.9 45.72,48.9 46.35,48.9 46.99,48.26 v46.99,37.94 | v37.47,29.21 36.09,29.21 35.49,28.61 34.99,28.61 34.39,29.21 v33.34,29.21 33.18,29.37 | 39.27,48.9 v39.37,48.9 | 37.53,50.29 39.09,50.29 39.37,50.01 v39.37,48.9
  Bottom 0.305: v33.34,29.21 34.35,29.21
  Bottom 0.406: v68.58,62.87 68.58,60.48 67.72,59.62 40.07,59.62 40.07,59.12 37.53,56.58 37.53,50.29 36.99,49.75 36.99,48.74 37.28,48.45 37.28,34.29 | v33.34,29.21 34.64,30.51 37.1,30.51 37.28,30.69 37.28,34.29 | v77.31,14.76 77.31,6.35 76.68,5.71 v74.14,5.71 v42.55,5.71 38.1,5.71 37.47,6.35 37.47,12.22 37.47,19.37 v37.47,29.21 | v27.94,38.1 27.94,34.77 28.42,34.29 37.28,34.29
VCTCXO_EN
  Top 0.152: U$1.3 43.55,36.62 44.31,35.86 51.74,35.86 52.39,36.51 52.39,44.77 53.02,45.4 74.3,45.4 | U3.8 74.45,40.64 74.3,40.8 74.3,45.4 | R14.1 75.09,48.26 74.93,48.1 74.93,45.56 74.77,45.4 74.3,45.4
VCXO_CTRL  (via drill 0.35)
  Top 0.152: R42.2 61.7,34.71 61.91,34.92 61.91,36.04 62.07,36.2 IC1.7 64.77,36.2 65.41,35.56 R39.2 C13.2 65.56,37.78 v65.09,38.26 | U4.1 94.71,37.56 v94.61,37.47 | v78.74,37.31 U3.10 | SV5.2 v90.17,49.69
  Bottom 0.152: v94.61,37.47 90.17,37.47 | 90.17,37.47 78.9,37.47 | 78.74,37.47 78.9,37.47 | 78.9,37.47 v78.74,37.31 77.79,38.26 v65.09,38.26 | v90.17,49.69 90.17,37.47
VCXO_EN
  Top 0.152: U$1.4 43.48,37.12 44.43,36.16 51.61,36.16 52.09,36.64 52.09,44.89 52.9,45.7 74.44,45.7 74.61,45.88 74.61,48.9 74.77,49.05 87.63,49.05 | 87.63,49.05 90.81,49.05 90.96,48.9 90.96,48.42 91.12,48.26 R7.2 91.86,47.05 92.23,46.67 96.2,46.67 96.36,46.51 96.36,42.07 96.2,41.91 U4.2 | SV5.3 87.63,49.05
VDDCORE  (via drill 0.35)
  Top 0.152: U$1.24 37.08,47.69 36.83,47.94 C10.1 | U$1.8 45.15,39.12 45.24,39.05 C11.1 46.14,39.85 | 46.14,39.85 v45.09,39.85 | 46.14,39.85 C22.1 U$1.12 | C9.1 34.34,30.11 34.29,30.16 34.29,30.96 35.58,32.25 U$1.54 | L1.2 44.98,27.26 v44.62,27.62
  Top 0.254: v37.78,49.53 37.78,48.9 37.57,48.68 C10.1 | v35.24,29.21 35.24,29.84 34.98,30.11 34.34,30.11
  Bottom 0.152: v44.62,27.62 44.37,27.87 44.37,39.02 44.62,39.27 44.62,39.38 v45.09,39.85
  Bottom 0.254: v45.09,39.85 46.2,39.85 46.59,40.24 46.59,48.09 46.19,48.49 40.16,48.49 39.77,48.1 37.78,48.1
  Bottom 0.305: v37.78,49.53 37.78,48.1 37.78,30.48 37.31,30 36.04,30 v35.24,29.21
VDDPLL
  Top 0.152: U$1.64 40.58,32.29 40.64,32.23 C8.1 R46.2 44.19,31.33 44.36,31.16 L1.1 46.95,31.11
VREF  (via drill 0.35)
  Top 0.152: U6.1 56.06,48.44 56.2,48.58 56.83,48.58 | 56.83,48.58 57.31,48.58 57.63,48.26 R23.1 58.9,48.32 58.9,49.05 59.05,49.21 63.5,49.21 | TP6.TP 63.5,49.21 | U$1.1 44.12,35.62 44.98,34.77 C26.2 46.14,35.34 46.35,35.56 52.22,35.56 v52.46,35.8 | v56.83,47.94 56.83,48.58 | R40.1 v55.88,31.11 | IC4.6 65.41,50.16 65.25,50.01 65.25,49.53 64.93,49.21 63.5,49.21
  Bottom 0.152: v52.46,35.8 55.49,35.8 56.04,36.35 | 56.04,36.35 56.04,47.15 v56.83,47.94 | v55.88,31.11 55.88,31.43 56.2,31.75 56.2,36.2 56.04,36.35
VREF_HALF
  Top 0.152: IC1.3 59.69,34.92 60.01,34.61 60.01,33.97 60.33,33.66 | 60.33,33.66 IC1.5 65.25,33.66 65.56,33.34 C16.2 | R40.2 60.33,31.11 | 60.33,31.11 R41.2 | 60.33,33.66 60.33,31.11

## Text on the board
Top: Top | osmocom e1 usb interface
Bottom: Bot
tNames: e1_sam4_usb | vogelchr@vogel.cx / 2018-07-09 final | ERASE | GND - - RxD TxD -